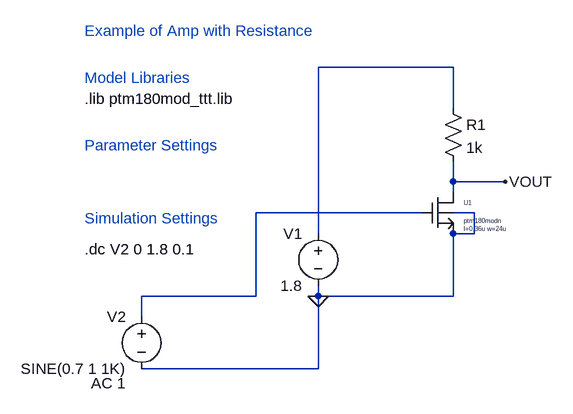
[diagram p0: schematic amp_with_resistance.asc]
amp_with_resistance.asc, the LTspice schematic file:
Version 4
SHEET 1 880 680
WIRE 224 0 16 0
WIRE 224 64 224 0
WIRE 224 176 224 144
WIRE 304 176 224 176
WIRE 224 192 224 176
WIRE 176 224 -80 224
WIRE 256 224 224 224
WIRE 16 256 16 0
WIRE 256 256 256 224
WIRE 256 256 224 256
WIRE -80 352 -80 224
WIRE -80 352 -256 352
WIRE 16 352 16 336
WIRE 224 352 224 256
WIRE 224 352 16 352
WIRE -256 384 -256 352
WIRE 16 464 16 352
WIRE 16 464 -256 464
FLAG 16 352 0
FLAG 304 176 VOUT
SYMBOL voltage 16 240 M0
SYMATTR InstName V1
SYMATTR Value 1.8
SYMBOL res 208 48 R0
SYMATTR InstName R1
SYMATTR Value 1k
SYMBOL cnm25mod_nmos4 176 192 R0
SYMATTR SpiceModel ptm180modn
SYMATTR InstName U1
SYMATTR Value l=0.36u w=24u
SYMBOL voltage -256 368 M0
WINDOW 123 24 118 Left 2
WINDOW 39 0 0 Left 0
SYMATTR Value2 AC 1
SYMATTR InstName V2
SYMATTR Value SINE(0.7 1 1K)
TEXT -344 120 Left 2 ;Parameter Settings
TEXT -344 232 Left 2 ;Simulation Settings
TEXT -344 16 Left 2 ;Model Libraries
TEXT -344 -56 Left 2 ;Example of Amp with Resistance
TEXT -344 48 Left 2 !.lib ptm180mod_ttt.lib
TEXT -344 280 Left 2 !.dc V2 0 1.8 0.1

The netlist it stands for:
* amp_with_resistance.asc
V1 N001 0 1.8
R1 N001 VOUT 1k
XU1 VOUT N002 0 0 ptm180modn l=0.36u w=24u  ; pins D G S B
V2 N002 0 SINE(0.7 1 1K) AC 1
* Parameter Settings
* Simulation Settings
* Model Libraries
* Example of Amp with Resistance
.lib ptm180mod_ttt.lib
.dc V2 0 1.8 0.1
.backanno
.end